# EAGLE design Winston-TOP (EAGLE 9.5.1)
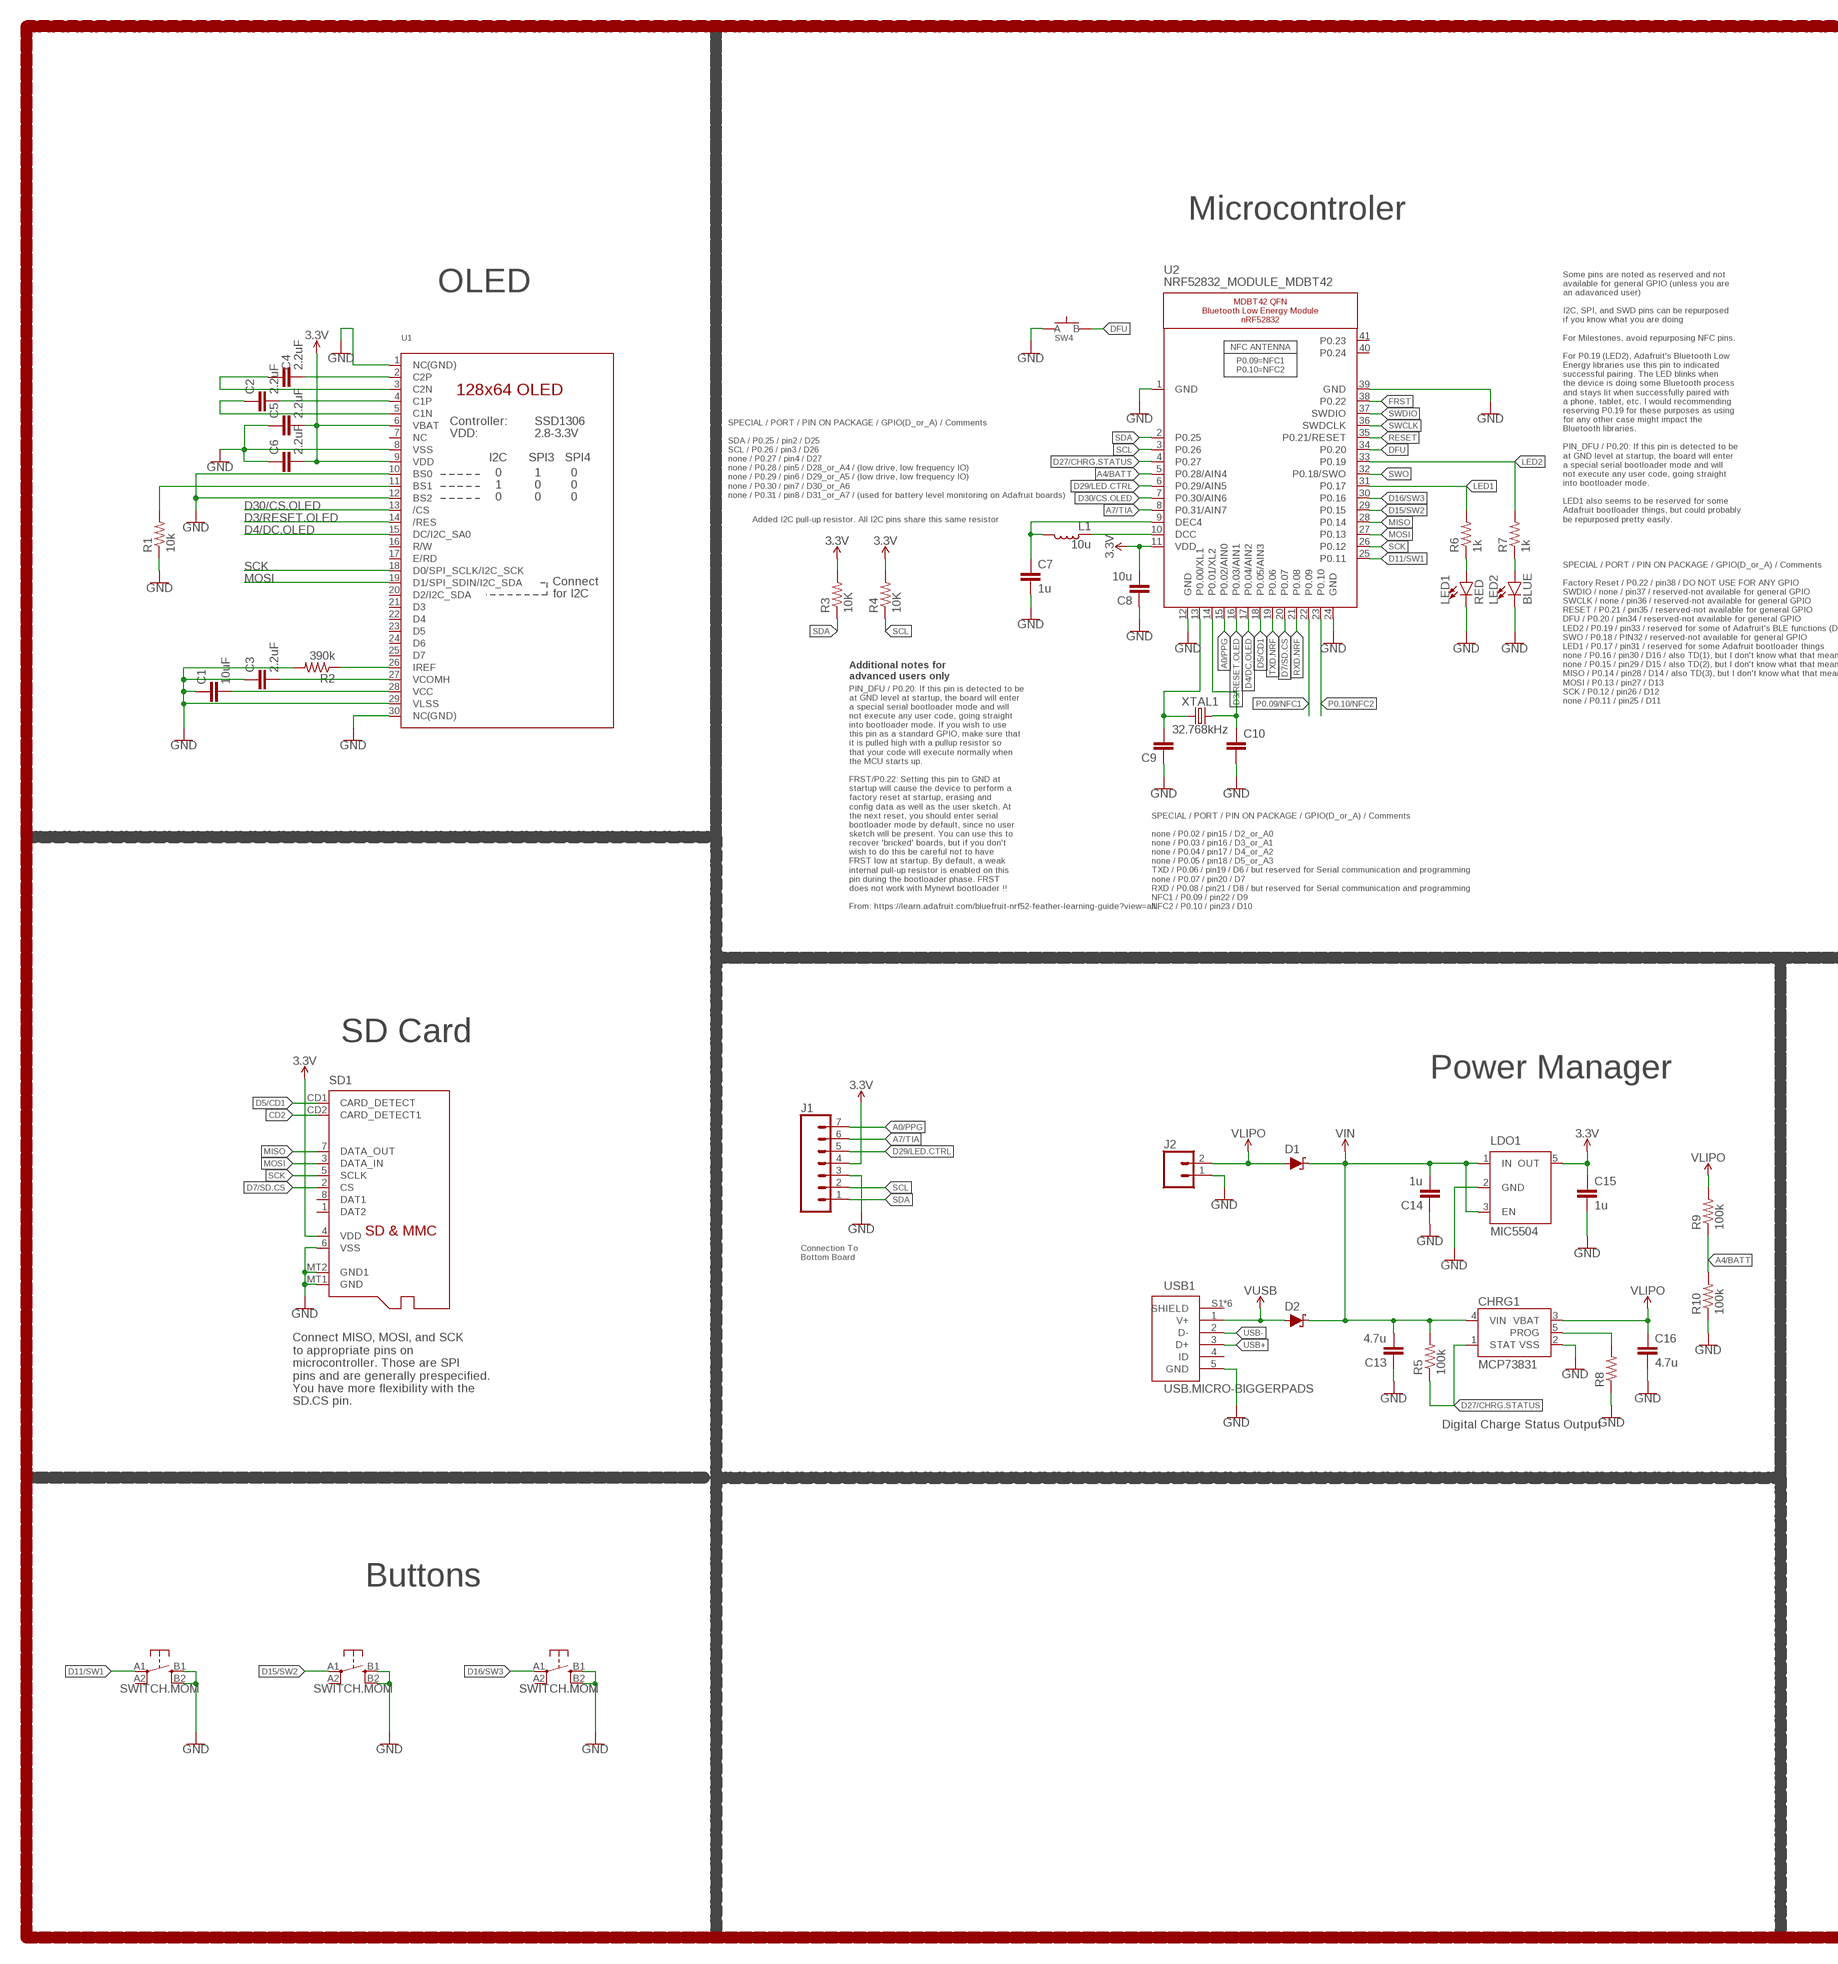
[diagram p0: schematic, sheet 1, part 1 of 2]
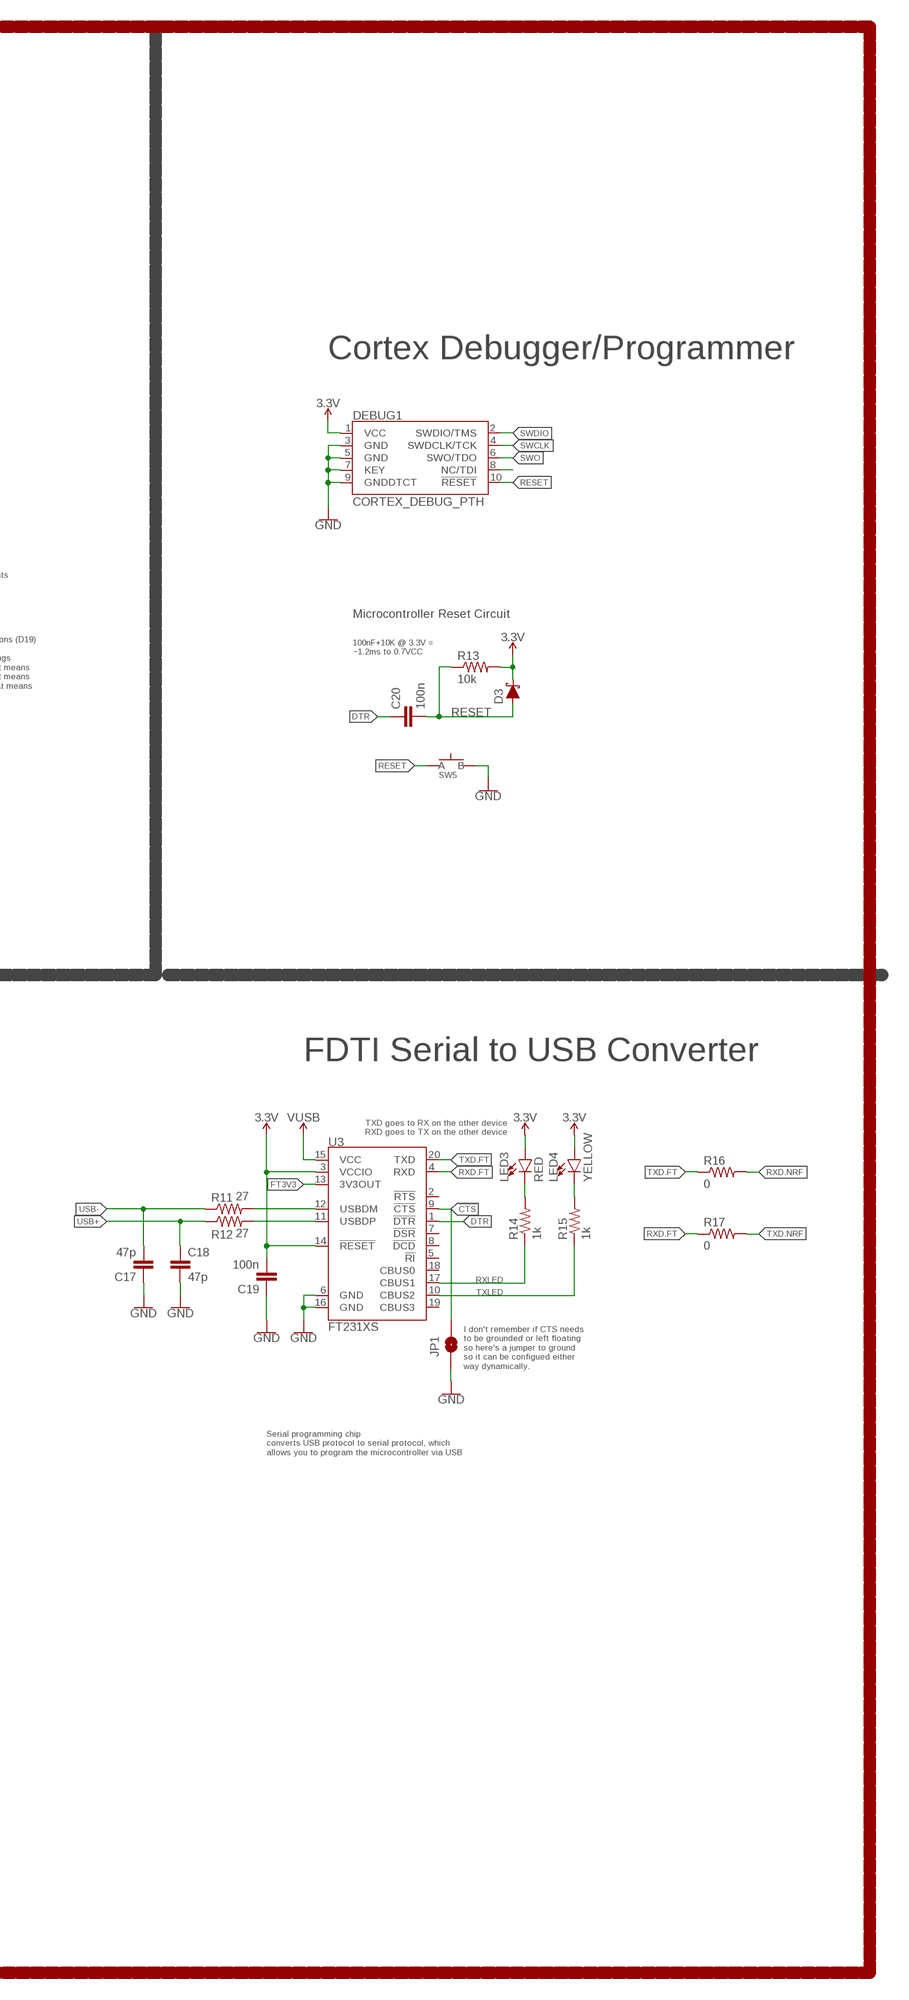
[diagram p1: schematic, sheet 1, part 2 of 2]

## Parts
C1  10uF  CAPACITOR0603  [C0603]
C2  2.2uF  CAPACITOR0402  [C0402]
C3  2.2uF  CAPACITOR0402  [C0402]
C4  2.2uF  CAPACITOR0402  [C0402]
C5  2.2uF  CAPACITOR0402  [C0402]
C6  2.2uF  CAPACITOR0402  [C0402]
C7  1u  CAPACITOR0603  [C0603]
C8  10u  CAPACITOR0805  [C0805]
C9  CAPACITOR0603  [C0603]
C10  CAPACITOR0603  [C0603]
C13  4.7u  CAPACITOR0603  [C0603]
C14  1u  CAPACITOR0603  [C0603]
C15  1u  CAPACITOR0603  [C0603]
C16  4.7u  CAPACITOR0603  [C0603]
C17  47p  CAPACITOR0603  [C0603]
C18  47p  CAPACITOR0603  [C0603]
C19  100n  CAPACITOR0603  [C0603]
C20  100n  CAPACITOR0603  [C0603]
CHRG1  MCP73831  [SOT23-5]
D1  SCHOTTKY-USC  [USC]
D2  SCHOTTKY-USC  [USC]
D3  SCHOTTKY-USC  [USC]
DEBUG1  CORTEX_DEBUG_PTH  [2X5-PTH-1.27MM]
J1  CONN_07-1.27MM  [1X07_1.27MM]
J2  CONN_02  [1X02]
JP1  JUMPER-SMT_2_NO_SILK  [SMT-JUMPER_2_NO_SILK]
L1  10u  INDUCTOR0603  [L0603]
LDO1  MIC5504  [SOT23-5]
LED1  RED  LED0603  [LED-0603]
LED2  BLUE  LED0603  [LED-0603]
LED3  RED  LED0603  [LED-0603]
LED4  YELLOW  LED0603  [LED-0603]
R1  10k  RESISTOR0603  [R0603]
R2  390k  RESISTOR0603  [R0603]
R3  10K  RESISTOR0603  [R0603]
R4  10K  RESISTOR0603  [R0603]
R5  100k  RESISTOR0603  [R0603]
R6  1k  RESISTOR0603  [R0603]
R7  1k  RESISTOR0603  [R0603]
R8  RESISTOR0603  [R0603]
R9  100k  RESISTOR0603  [R0603]
R10  100k  RESISTOR0603  [R0603]
R11  27  RESISTOR0603  [R0603]
R12  27  RESISTOR0603  [R0603]
R13  10k  RESISTOR0603  [R0603]
R14  1k  RESISTOR0603  [R0603]
R15  1k  RESISTOR0603  [R0603]
R16  0  RESISTOR0603  [R0603]
R17  0  RESISTOR0603  [R0603]
SD1  MICROSD  [MICROSD]
SW1  SWITCH.MOM  [TACTILE_SWITCH_SMD_6.2MM_TALL]
SW2  SWITCH.MOM  [TACTILE_SWITCH_SMD_6.2MM_TALL]
SW3  SWITCH.MOM  [TACTILE_SWITCH_SMD_6.2MM_TALL]
SW4  SPST-PTS830GG140-COPY.1-3  [BUTTON-GULLWING]
SW5  SPST-PTS830GG140-COPY.1-3  [BUTTON-GULLWING]
U1  DISP_OLED_UG-2864HSWEG01-NO-WRAPAROUND  [UG-2864HSWEG01_0.96IN_NO-WRAPAROUND]
U2  NRF52832_MODULE_MDBT42  [BLE_MODULE_RAYTAC_MDBT42]
U3  FT231XS  [SSOP20_L]
USB1  USB.MICRO-BIGGERPADS  [USB-MICRO-01.BIGGERPADS]
XTAL1  32.768kHz  CRYSTALECS-.327-12.5-12-C-TR  [2-SMD.NOLEAD.2.0MMTO1.2MM]

## Nets
3.3V: C5.2 C6.2 C8.2 C15.1 C19.2 D3.-(C) DEBUG1.1(VCC) J1.4 LDO1.5(OUT) LED3.A LED4.A R3.2 R4.2 R13.2 SD1.4(VDD) U1.6(VBAT) U1.9(VDD) U2.11(VDD) U3.3(VCCIO) U3.14(!RESET)
!CTS: JP1.2 U3.9(!CTS)
A0/PPG: J1.7 U2.15(P0.02/AIN0)
A4/BATT: R9.1 R10.2 U2.5(P0.28/AIN4)
A7/TIA: J1.6 U2.8(P0.31/AIN7)
CD2: SD1.CD2(CARD_DETECT1)
D3/RESET.OLED: U1.14(/RES) U2.16(P0.03/AIN1)
D4/DC.OLED: U1.15(DC/I2C_SA0) U2.17(P0.04/AIN2)
D5/CD1: SD1.CD1(CARD_DETECT) U2.18(P0.05/AIN3)
D7/SD.CS: SD1.2(CS) U2.20(P0.07)
D11/SW1: SW1.A1 U2.25(P0.11)
D15/SW2: SW2.A1 U2.29(P0.15)
D16/SW3: SW3.A1 U2.30(P0.16)
D27/CHRG.STATUS: CHRG1.1(STAT) R5.1 U2.4(P0.27)
D29/LED.CTRL: J1.5 U2.6(P0.29/AIN5)
D30/CS.OLED: U1.13(/CS) U2.7(P0.30/AIN6)
DFU: SW4.3(B) U2.34(P0.20)
DTR: C20.1 U3.1(!DTR)
FRST: U2.38(P0.22)
FT3V3: U3.13(3V3OUT)
GND: C1.1 C3.1 C5.1 C6.1 C7.2 C8.1 C9.1 C10.2 C13.1 C14.1 C15.2 C16.2 C17.1 C18.2 C19.1 CHRG1.2(VSS) DEBUG1.3(GND) DEBUG1.5(GND) DEBUG1.7(KEY) DEBUG1.9(GNDDTCT) J1.3 J2.1 JP1.1 LDO1.2(GND) LED1.C LED2.C R1.1 R2.2 R8.1 R10.1 SD1.6(VSS) SD1.MT1(GND) SD1.MT2(GND1) SW1.B1 SW1.B2 SW2.B1 SW2.B2 SW3.B1 SW3.B2 SW4.1(A) SW5.3(B) U1.1(NC(GND)) U1.8(VSS) U1.10(BS0) U1.12(BS2) U1.29(VLSS) U1.30(NC(GND)) U2.1(GND) U2.12(GND) U2.24(GND) U2.39(GND) U3.6(GND) U3.16(GND) USB1.5(GND)
LED1: R6.2 U2.31(P0.17)
LED2: R7.2 U2.33(P0.19)
MISO: SD1.7(DATA_OUT) U2.28(P0.14)
MOSI: SD1.3(DATA_IN) U1.19(D1/SPI_SDIN/I2C_SDA) U2.27(P0.13)
N$1: R1.2 U1.11(BS1)
N$2: R2.1 U1.26(IREF)
N$3: C4.2 U1.2(C2P)
N$4: C9.2 U2.13(P0.00/XL1) XTAL1.P$1
N$5: C4.1 U1.3(C2N)
N$6: C10.1 U2.14(P0.01/XL2) XTAL1.P$2
N$7: C2.2 U1.4(C1P)
N$8: C2.1 U1.5(C1N)
N$9: LED1.A R6.1
N$10: LED2.A R7.1
N$11: L1.1 U2.10(DCC)
N$12: C7.1 L1.2 U2.9(DEC4)
N$13: C1.2 U1.28(VCC)
N$14: DEBUG1.8(NC/TDI)
N$15: C3.2 U1.27(VCOMH)
N$16: CHRG1.5(PROG) R8.2
N$23: R11.2 U3.12(USBDM)
N$24: R12.2 U3.11(USBDP)
N$25: LED3.C R14.2
N$26: LED4.C R15.2
P0.09/NFC1: U2.22(P0.09)
P0.10/NFC2: U2.23(P0.10)
RESET: C20.2 D3.+(A) DEBUG1.10(!RESET) R13.1 SW5.1(A) U2.35(P0.21/RESET)
RXD.FT: R17.1 U3.4(RXD)
RXD.NRF: R16.2 U2.21(P0.08)
RXLED: R14.1 U3.17(CBUS1)
SCK: SD1.5(SCLK) U1.18(D0/SPI_SCLK/I2C_SCK) U2.26(P0.12)
SCL: J1.2 R4.1 U2.3(P0.26)
SDA: J1.1 R3.1 U2.2(P0.25)
SWCLK: DEBUG1.4(SWDCLK/TCK) U2.36(SWDCLK)
SWDIO: DEBUG1.2(SWDIO/TMS) U2.37(SWDIO)
SWO: DEBUG1.6(SWO/TDO) U2.32(P0.18/SWO)
TXD.FT: R16.1 U3.20(TXD)
TXD.NRF: R17.2 U2.19(P0.06)
TXLED: R15.1 U3.10(CBUS2)
USB+: C18.1 R12.1 USB1.3(D+)
USB-: C17.2 R11.1 USB1.2(D-)
V_USB: D2.+(A) U3.15(VCC) USB1.1(V+) ; supply symbol labelled VUSB
VIN: C13.2 C14.2 CHRG1.4(VIN) D1.-(C) D2.-(C) LDO1.1(IN) LDO1.3(EN) R5.2
VLIPO: C16.1 CHRG1.3(VBAT) D1.+(A) J2.2 R9.2
Unconnected: SD1.1(DAT2) SD1.8(DAT1) SW1.A2 SW2.A2 SW3.A2 U1.7(NC) U1.16(R/W) U1.17(E/RD) U1.20(D2/I2C_SDA) U1.21(D3) U1.22(D4) U1.23(D5) U1.24(D6) U1.25(D7) U2.40(P0.24) U2.41(P0.23) U3.2(!RTS) U3.5(!RI) U3.7(!DSR) U3.8(!DCD) U3.18(CBUS0) U3.19(CBUS3) USB1.4(ID) USB1.S1(SHIELD) USB1.S2(SHIELD) USB1.S3(SHIELD) USB1.S4(SHIELD) USB1.S5(SHIELD) USB1.S6(SHIELD)

## Notes on the sheet
- Microcontroler
- OLED
- Cortex Debugger/Programmer
- SPECIAL / PORT / PIN ON PACKAGE / GPIO(D_or_A) / Comments
  
  SDA / P0.25 / pin2 / D25
  SCL / P0.26 / pin3 / D26
  none / P0.27 / pin4 / D27
  none / P0.28 / pin5 / D28_or_A4 / (low drive, low frequency IO)
  none / P0.29 / pin6 / D29_or_A5 / (low drive, low frequency IO)
  none / P0.30 / pin7 / D30_or_A6
  none / P0.31 / pin8 / D31_or_A7 / (used for battery level monitoring on Adafruit boards)
- Added I2C pull-up resistor. All I2C pins share this same resistor
- Some pins are noted as reserved and not
  available for general GPIO (unless you are
  an adavanced user)
  
  I2C, SPI, and SWD pins can be repurposed
  if you know what you are doing
  
  For Milestones, avoid repurposing NFC pins.
  
  For P0.19 (LED2), Adafruit's Bluetooth Low
  Energy libraries use this pin to indicated
  successful pairing. The LED blinks when
  the device is doing some Bluetooth process
  and stays lit when successfully paired with
  a phone, tablet, etc. I would recommending
  reserving P0.19 for these purposes as using
  for any other case might impact the
  Bluetooth libraries.
  
  PIN_DFU / P0.20: If this pin is detected to be
  at GND level at startup, the board will enter
  a special serial bootloader mode and will
  not execute any user code, going straight
  into bootloader mode.
  
  LED1 also seems to be reserved for some
  Adafruit bootloader things, but could probably
  be repurposed pretty easily.
- Microcontroller Reset Circuit
- 100nF+10K @ 3.3V =
  ~1.2ms to 0.7VCC
- Additional notes for
  advanced users only
- SPECIAL / PORT / PIN ON PACKAGE / GPIO(D_or_A) / Comments
  
  Factory Reset / P0.22 / pin38 / DO NOT USE FOR ANY GPIO
  SWDIO / none / pin37 / reserved-not available for general GPIO
  SWCLK / none / pin36 / reserved-not available for general GPIO
  RESET / P0.21 / pin35 / reserved-not available for general GPIO
  DFU / P0.20 / pin34 / reserved-not available for general GPIO
  LED2 / P0.19 / pin33 / reserved for some of Adafruit's BLE functions (D19)
  SWO / P0.18 / PIN32 / reserved-not available for general GPIO
  LED1 / P0.17 / pin31 / reserved for some Adafruit bootloader things
  none / P0.16 / pin30 / D16 / also TD(1), but I don't know what that means
  none / P0.15 / pin29 / D15 / also TD(2), but I don't know what that means
  MISO / P0.14 / pin28 / D14 / also TD(3), but I don't know what that means
  MOSI / P0.13 / pin27 / D13
  SCK / P0.12 / pin26 / D12
  none / P0.11 / pin25 / D11
- PIN_DFU / P0.20: If this pin is detected to be
  at GND level at startup, the board will enter
  a special serial bootloader mode and will
  not execute any user code, going straight
  into bootloader mode. If you wish to use
  this pin as a standard GPIO, make sure that
  it is pulled high with a pullup resistor so
  that your code will execute normally when
  the MCU starts up.
  
  FRST/P0.22: Setting this pin to GND at
  startup will cause the device to perform a
  factory reset at startup, erasing and
  config data as well as the user sketch. At
  the next reset, you should enter serial
  bootloader mode by default, since no user
  sketch will be present. You can use this to
  recover 'bricked' boards, but if you don't
  wish to do this be careful not to have
  FRST low at startup. By default, a weak
  internal pull-up resistor is enabled on this
  pin during the bootloader phase. FRST
  does not work with Mynewt bootloader !!
  
  From: https://learn.adafruit.com/bluefruit-nrf52-feather-learning-guide?view=all
- SPECIAL / PORT / PIN ON PACKAGE / GPIO(D_or_A) / Comments
  
  none / P0.02 / pin15 / D2_or_A0
  none / P0.03 / pin16 / D3_or_A1
  none / P0.04 / pin17 / D4_or_A2
  none / P0.05 / pin18 / D5_or_A3
  TXD / P0.06 / pin19 / D6 / but reserved for Serial communication and programming
  none / P0.07 / pin20 / D7
  RXD / P0.08 / pin21 / D8 / but reserved for Serial communication and programming
  NFC1 / P0.09 / pin22 / D9
  NFC2 / P0.10 / pin23 / D10
- SD Card | FDTI Serial to USB Converter
- Power Manager
- TXD goes to RX on the other device
  RXD goes to TX on the other device
- Connection To
  Bottom Board
- I don't remember if CTS needs
  to be grounded or left floating
  so here's a jumper to ground
  so it can be configued either
  way dynamically.
- Connect MISO, MOSI, and SCK
  to appropriate pins on
  microcontroller. Those are SPI
  pins and are generally prespecified.
  You have more flexibility with the
  SD.CS pin.
- Serial programming chip
  converts USB protocol to serial protocol, which 
  allows you to program the microcontroller via USB
- Digital Charge Status Output
- Buttons

## Library data of the parts
C1-C10 C13-C20 = LinnesLab-Passives:CAPACITOR
CHRG1 = LinnesLab-Power:MCP73831: MCP73831T Li-Ion, Li-Pol Controller Miniature single cell, fully integrated Li-Ion, Li-polymer charge management controller Datasheet <http://ww1.microchip.com/downloads/en/DeviceDoc/20001984g.pdf> SparkFun Products: SparkFun ESP32 Thing <https://www.sparkfun.com/products/13907> SparkFun 9DoF Razor IMU M0 <https://www.sparkfun.com/products/14001>; PROD_ID: IC-09995
D1-D3 = LinnesLab-DiscreteSemi:SCHOTTKY: Schottky diode A Schottky diode is a semiconductor diode which has a low forward voltage drop and a very fast switching action. Example: Digi-Key Part Number: RB161MM-20CT-ND
DEBUG1 = LinnesLab-Connectors:CORTEX_DEBUG: Cortex Debug Connector - 10 pin Supports JTAG debug, Serial Wire debug, and Serial Wire Viewer. PTH and SMD connector options available. General Connector Information <http://infocenter.arm.com/help/topic/com.arm.doc.faqs/attached/13634/cortex_debug_connectors.pdf> Products: PTH Connector <http://www.digikey.com/product-detail/en/cnc-tech/3220-10-0100-00/1175-1627-ND/3883661> -via Digi-Key SparkFun PSoc <https://www.sparkfun.com/products/13229> SparkFun T <https://www.sparkfun.com/products/13810>
J1 = LinnesLab-Connectors:CONN_07: Multi connection point. Often used as Generic Header-pin footprint for 0.1 inch spaced/style header connections On any of the 0.1 inch spaced packages, you can populate with these: Break Away Headers - Straight <https://www.sparkfun.com/products/116> (PRT-00116) Break Away Male Headers - Right Angle <https://www.sparkfun.com/products/553> (PRT-00553) Female Headers <https://www.sparkfun.com/products/115> (PRT-00115) Break Away Headers - Machine Pin <https://www.sparkfun.com/products/117> (PRT-00117) Break Away Female Headers - Swiss Machine Pin <https://www.sparkfun.com/products/743> (PRT-00743) For SCREWTERMINALS and SPRING TERMINALS visit here: Screw Terimnals on SparkFun.com <https://www.sparkfun.com/search/results?term=Screw+Terminals> (5mm/3.5mm/2.54mm spacing) This device is also useful as a general connection point to wire up your design to another part of your project. Our various solder wires solder well into these plated through hole pads. Hook-Up Wire - Assortment (Stranded, 22 AWG) <https://www.sparkfun.com/products/11375> (PRT-11375) Hook-Up Wire - Assortment (Solid Core, 22 AWG) <https://www.sparkfun.com/products/11367> (PRT-11367) View the entire wire category on our website here <https://www.sparkfun.com/categories/141> Special notes: Molex polarized connector foot print use with SKU : PRT-08231 with associated crimp pins and housings. 1MM SMD Version SKU: PRT-10208 NOTES ON THE VARIANTS LOCK and LOCK_LONGPADS... This footprint was designed to help hold the alignment of a through-hole component (i.e. 6-pin header) while soldering it into place. You may notice that each hole has been shifted either up or down by 0.005 of an inch from it's more standard position (which is a perfectly straight line). This slight alteration caused the pins (the squares in the middle) to touch the edges of the holes. Because they are alternating, it causes a "brace" to hold the component in place. 0.005 has proven to be the perfect amount of "off-center" position when using our standard breakaway headers. Although looks a little odd when you look at the bare footprint, once you have a header in there, the alteration is very hard to notice. Also,if you push a header all the way into place, it is covered up entirely on the bottom side.
J2 = LinnesLab-Connectors:CONN_02: Multi connection point. Often used as Generic Header-pin footprint for 0.1 inch spaced/style header connections On any of the 0.1 inch spaced packages, you can populate with these: Break Away Headers - Straight <https://www.sparkfun.com/products/116> (PRT-00116) Break Away Male Headers - Right Angle <https://www.sparkfun.com/products/553> (PRT-00553) Female Headers <https://www.sparkfun.com/products/115> (PRT-00115) Break Away Headers - Machine Pin <https://www.sparkfun.com/products/117> (PRT-00117) Break Away Female Headers - Swiss Machine Pin <https://www.sparkfun.com/products/743> (PRT-00743) For SCREWTERMINALS and SPRING TERMINALS visit here: Screw Terimnals on SparkFun.com <https://www.sparkfun.com/search/results?term=Screw+Terminals> (5mm/3.5mm/2.54mm spacing) This device is also useful as a general connection point to wire up your design to another part of your project. Our various solder wires solder well into these plated through hole pads. Hook-Up Wire - Assortment (Stranded, 22 AWG) <https://www.sparkfun.com/products/11375> (PRT-11375) Hook-Up Wire - Assortment (Solid Core, 22 AWG) <https://www.sparkfun.com/products/11367> (PRT-11367) View the entire wire category on our website here <https://www.sparkfun.com/categories/141> Special notes: Molex polarized connector foot print use with: PRT-08233 with associated crimp pins and housings. 2.54_SCREWTERM for use with PRT-10571. 3.5mm Screw Terminal footprints for PRT-08084 5mm Screw Terminal footprints for use with PRT-08432
JP1 = LinnesLab-Switches:JUMPER-SMT_2_NO: Normally open jumper This jumper has two pads in close proximity to each other. Apply solder to close the connection. Round pads are easier to solder for beginners, but are a lot larger. SparkFun Product that uses the round pads: SparkFun EL Sequencer <https://www.sparkfun.com/products/12781>
L1 = LinnesLab-Passives:INDUCTOR
LDO1 = LinnesLab-Power:MIC5504: MIC5504 Voltage Regulator Output Voltages: 1.0V to 3.3V Input Voltages: 2.5V to 5.5V Link to Datasheet http://ww1.microchip.com/downloads/en/DeviceDoc/MIC550X.pdf
LED1-LED4 = LinnesLab-LED:LED: LED (Generic) Standard schematic elements and footprints for 5mm, 3mm, 1206, and 0603 sized LEDs. Generic LEDs with no color specified. LTST-C190KGKT: arrow indicates cathode
R1-R17 = LinnesLab-Passives:RESISTOR
SD1 = LinnesLab-Connectors:MICROSD: Micro-SD / Transflash card holder with SPI pinout For the 3M # 2908-05WB-MG and/or 4UCON #19656 push-push type
SW1-SW3 = LinnesLab-Switches:SWITCH.MOM: PTS645SM43SMTR92 LFS
SW4 SW5 = LinnesLab-Switches:SPST-PTS830GG140-COPY
U1 = LinnesLab-Displays:DISP_OLED_UG-2864HSWEG01: UG-2864HSWEG01 OLED display Both 1.3" and 0.96" models share the same FPC tab footprint, only the screen dimensions vary.
U2 = LinnesLab-Microcontrollers:NRF52832_MODULE_MDBT42: MDBT42 - BLE Module (nRF52832 QFN) VDD: 1.7-3.6V
U3 = LinnesLab-DigitalIC:FT231X: FTDI FT231X Full Speed USB to Full-handshake UART This USB2.0 Full Speed IC offers a compact bridge to full handshake UART interfaces. The device is a UART, capable of operating up to 3MBaud, with low power consumption (8mA). The FT231X includes the complete FT-X series feature set and enables USB to be added into a system design quickly and easily over a UART interface. Datasheet <http://cdn.sparkfun.com/datasheets/Components/General%20IC/DS_FT231X.pdf>; DIGIKEY: 768-1156-5-ND; MFN: FT231XS-U
USB1 = LinnesLab-Connectors:USB.MICRO: DigiKey PN: 609-4613-1-ND
XTAL1 = LinnesLab-Clocks:CRYSTAL; DIGIKEY: XC2288CT-ND; FREQ: 32.7680KHZ; LOAD_CAP: 12.5pF

## Board
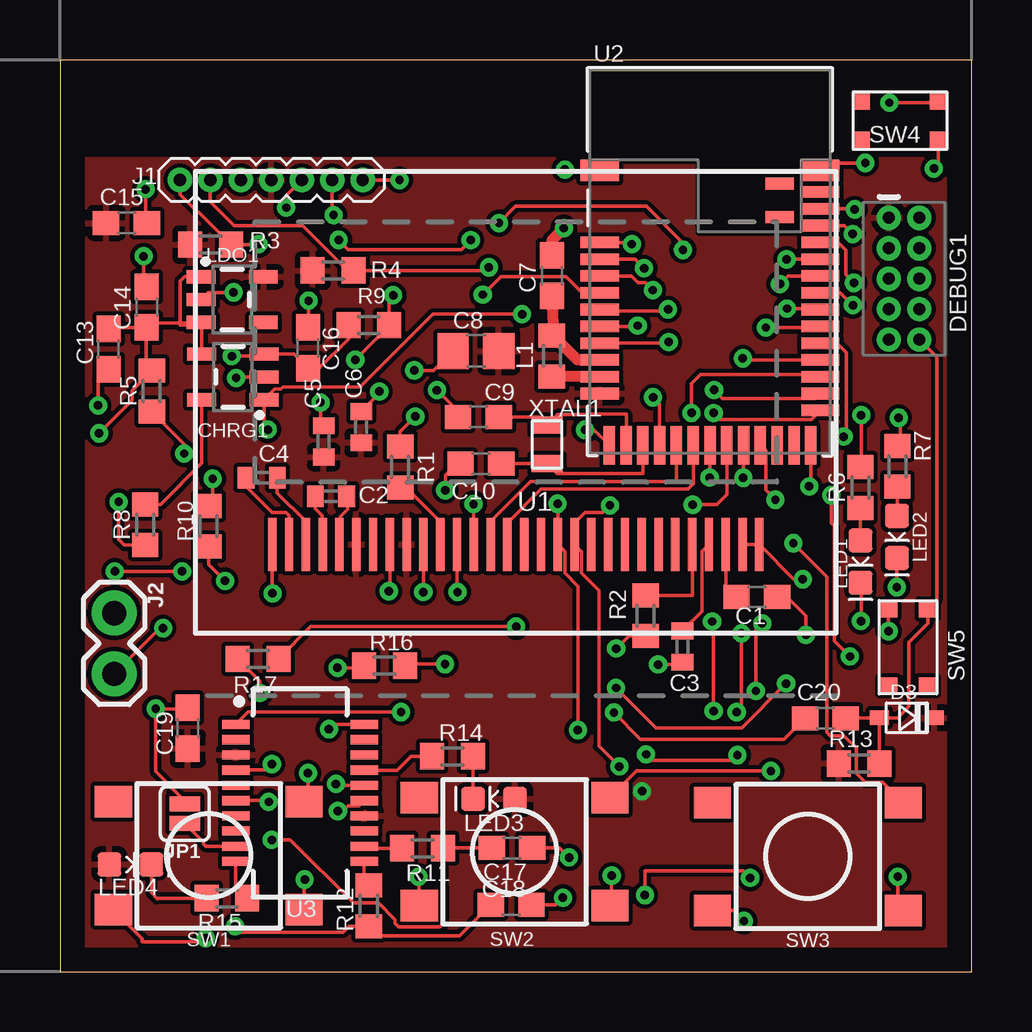
[diagram p2: board, top side]
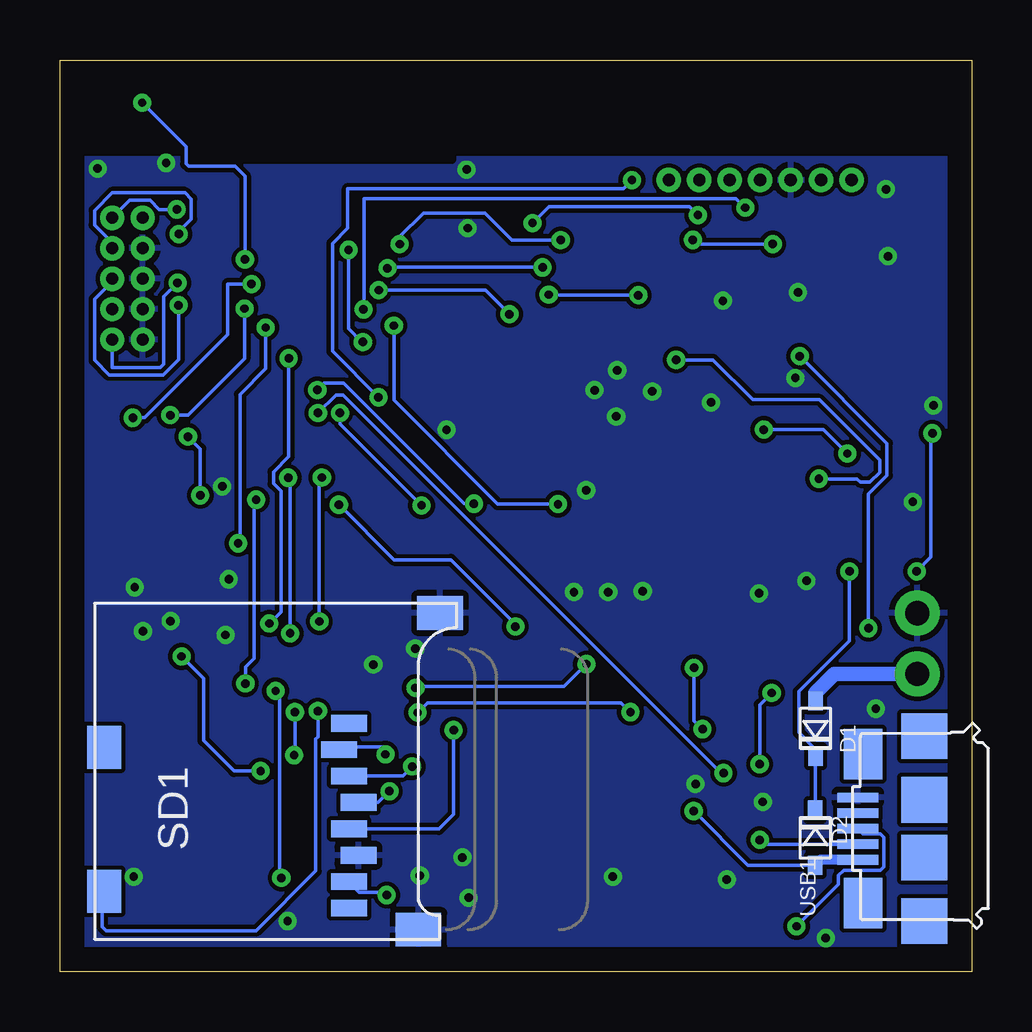
[diagram p3: board, bottom side, seen from below]

Size 38 x 38 mm. Coordinates in mm from the lower left corner, seen from the top.
Outline: 0,0 38,0 38,38 0,38 0,0
Copper layers (1*16): Top 0.035mm / dielectric 1.5mm / Bottom 0.035mm
Design rules "default": minimum track width 6mil, minimum drill 0.35mm, track to track 6mil, track to pad 6mil, pad to pad 6mil, via to via 6mil, smd to smd 6mil, copper to edge 40mil, drill to drill 6mil, minimum pad ring 10mil, minimum via ring 8mil, stop-mask expansion 4mil, vias tented up to drill 0mil, thermal gap 10mil

### Footprints (pad centres in the part's own frame; a part is rotated, then mirrored left to right if it is on the bottom)
C0603 = smd 1.1 x 1: 1 -0.85,0; 2 0.85,0
C0402 = smd 0.7 x 0.9: 1 -0.65,0; 2 0.65,0
C0805 = smd 1.3 x 1.5: 1 -0.95,0; 2 0.95,0
SOT23-5 = smd 0.55 x 1.2: 1 -0.95,-1.3; 2 0,-1.3; 3 0.95,-1.3; 4 0.95,1.3; 5 -0.95,1.3
USC = smd 0.8 x 0.6: + -1.15,0; - 1.15,0
2X5-PTH-1.27MM = drill 0.508 pad 1: 1 -2.54,-0.635; 2 -2.54,0.635; 3 -1.27,-0.635; 4 -1.27,0.635; 5 0,-0.635; 6 0,0.635; 7 1.27,-0.635; 8 1.27,0.635; 9 2.54,-0.635; 10 2.54,0.635
1X07_1.27MM = drill 0.508 pad 1: 1 0,0; 2 1.27,0; 3 2.54,0; 4 3.81,0; 5 5.08,0; 6 6.35,0; 7 7.62,0
1X02 = drill 1.016 pad 1.88: 1 0,0; 2 2.54,0
SMT-JUMPER_2_NO_SILK = smd 0.635 x 1.27: 1 -0.406,0; 2 0.406,0
L0603 = smd 1 x 1.1: 1 -0.85,0; 2 0.85,0
LED-0603 = smd 1 x 1: A -0.877,0; C 0.877,0
R0603 = smd 1 x 1.1: 1 -0.85,0; 2 0.85,0
MICROSD = smd 0.7 x 1.5: 1 9,-10.64; 2 7.9,-10.24; 3 6.8,-10.64; 4 5.7,-11.04; 5 4.6,-10.64; 6 3.5,-11.04; 7 2.4,-10.64; 8 1.3,-10.64 | smd 1.8 x 1.4: CD1 2,-0.44; CD2 8,-0.44 | smd 1.4 x 1.9: MT1 0.4,-13.54; MT2 13.6,-14.44
TACTILE_SWITCH_SMD_6.2MM_TALL = smd 1.55 x 1.3: A1 -3.975,-2.25; A2 3.975,-2.25; B1 -3.975,2.25; B2 3.975,2.25
BUTTON-GULLWING = smd 0.7 x 0.75: 1 -1.6,0.825; 2 1.6,0.825; 3 -1.6,-0.825; 4 1.6,-0.825
UG-2864HSWEG01_0.96IN_NO-WRAPAROUND = smd 0.35 x 2.2: 1 -10.15,-1.2; 2 -9.45,-1.2; 3 -8.75,-1.2; 4 -8.05,-1.2; 5 -7.35,-1.2; 6 -6.65,-1.2; 7 -5.95,-1.2; 8 -5.25,-1.2; 9 -4.55,-1.2; 10 -3.85,-1.2; 11 -3.15,-1.2; 12 -2.45,-1.2; 13 -1.75,-1.2; 14 -1.05,-1.2; 15 -0.35,-1.2; 16 0.35,-1.2; 17 1.05,-1.2; 18 1.75,-1.2; 19 2.45,-1.2; 20 3.15,-1.2; 21 3.85,-1.2; 22 4.55,-1.2; 23 5.25,-1.2; 24 5.95,-1.2; 25 6.65,-1.2; 26 7.35,-1.2; 27 8.05,-1.2; 28 8.75,-1.2; 29 9.45,-1.2; 30 10.15,-1.2
BLE_MODULE_RAYTAC_MDBT42 = smd 1.6 x 0.9: 1 -4.6,3.8; 39 4.6,3.8 | smd 1.6 x 0.48: 2 -4.6,0.8; 3 -4.6,0.1; 4 -4.6,-0.6; 5 -4.6,-1.3; 6 -4.6,-2; 7 -4.6,-2.7; 8 -4.6,-3.4; 9 -4.6,-4.1; 10 -4.6,-4.8; 11 -4.6,-5.5; 25 4.6,-6.2; 26 4.6,-5.5; 27 4.6,-4.8; 28 4.6,-4.1; 29 4.6,-3.4; 30 4.6,-2.7; 31 4.6,-2; 32 4.6,-1.3; 33 4.6,-0.6; 34 4.6,0.1; 35 4.6,0.8; 36 4.6,1.5; 37 4.6,2.2; 38 4.6,2.9 | smd 0.48 x 1.6: 12 -4.2,-7.65; 13 -3.5,-7.65; 14 -2.8,-7.65; 15 -2.1,-7.65; 16 -1.4,-7.65; 17 -0.7,-7.65; 18 0,-7.65; 19 0.7,-7.65; 20 1.4,-7.65; 21 2.1,-7.65; 22 2.8,-7.65; 23 3.5,-7.65; 24 4.2,-7.65 | smd 1.2 x 0.5: 40 2.9,3.25; 41 2.9,1.85
SSOP20_L = smd 0.381 x 1.143: 1 -2.857,-2.68; 2 -2.223,-2.68; 3 -1.587,-2.68; 4 -0.953,-2.68; 5 -0.318,-2.68; 6 0.318,-2.68; 7 0.953,-2.68; 8 1.587,-2.68; 9 2.223,-2.68; 10 2.857,-2.68; 11 2.857,2.68; 12 2.223,2.68; 13 1.587,2.68; 14 0.953,2.68; 15 0.318,2.68; 16 -0.318,2.68; 17 -0.953,2.68; 18 -1.587,2.68; 19 -2.223,2.68; 20 -2.857,2.68
USB-MICRO-01.BIGGERPADS = smd 0.4 x 1.7: 1 -1.3,1.505; 2 -0.65,1.505; 3 0,1.505; 4 0.65,1.505; 5 1.3,1.505 | smd 1.9 x 1.9: S1 -3.85,-1.27; S2 -1.2,-1.27; S3 1.2,-1.27; S4 3.85,-1.27 | smd 2.1 x 1.6: S5 -3.1,1.28; S6 3.1,1.28
2-SMD.NOLEAD.2.0MMTO1.2MM = smd 0.7 x 1.3: P$1 -0.8,0; P$2 0.8,0

### Placement (x,y rotation side)
C1  29.05,15.62 180 top
C2  11.29,19.82 180 top
C3  25.95,13.54 90 top
C4  8.41,20.58 180 top
C5  10.99,22.1 270 top
C6  12.56,22.69 270 top
C7  20.52,29.01 90 top
C8  17.34,25.87 0 top
C9  17.44,23.11 0 top
C10  17.55,21.17 180 top
C13  2.02,25.95 90 top
C14  3.62,27.7 270 top
C15  2.77,31.21 0 top
C16  10.35,26 90 top
C17  18.84,5.16 180 top
C18  18.81,2.79 0 top
C19  5.32,10.15 270 top
C20  31.9,10.56 0 top
CHRG1  7.21,24.79 90 top
D1  6.51,10.13 270 bottom
D2  6.52,5.58 90 bottom
D3  35.3,10.58 0 top
DEBUG1  35.19,28.88 270 top
J1  5,33 0 top
J2  2.26,14.95 270 top
JP1  5.2,6.58 270 top
L1  20.51,25.66 90 top
LDO1  7.18,28.01 270 top
LED1  33.37,17.09 270 top
LED2  34.89,18.12 270 top
LED3  18.09,7.2 180 top
LED4  2.94,4.46 0 top
R1  14.18,21.03 270 top
R2  24.41,14.83 270 top
R3  6.28,30.3 180 top
R4  11.39,29.23 180 top
R5  3.83,24.2 90 top
R6  33.36,20.18 90 top
R7  34.9,21.06 90 top
R8  3.55,18.62 90 top
R9  12.87,26.95 180 top
R10  6.2,18.56 90 top
R11  15.11,5.14 180 top
R12  12.88,2.74 90 top
R13  33.31,8.67 180 top
R14  16.36,8.97 0 top
R15  6.96,3.06 180 top
R16  13.53,12.76 0 top
R17  8.26,13.03 0 top
SD1  36.6,1.35 90 bottom
SW1  6.2,4.83 180 top
SW2  18.95,5 180 top
SW3  31.18,4.8 180 top
SW4  35.02,35.47 180 top
SW5  35.35,13.52 270 top
U1  19,19 0 top
U2  27.1,29.59 0 top
U3  10.01,7.44 270 top
USB1  3.24,5.96 90 bottom
XTAL1  20.3,21.98 270 top

### Tracks (layer width: path | path; a pad name or v marks a point on that pad's centre or on a via)
3.3V  (via drill 0.35)
  Bottom 0.152: SD1.4 24.74,7.05 v24.27,7.51
  pour Top (isolate 0.178): 0.81,33.89 37.3,33.89 37.3,0.41 0.8,0.41 0.8,33.87
!CTS
  Top 0.152: JP1.2 5.99,5.38 5.99,5.3 6.07,5.22 U3.9
A0/PPG  (via drill 0.35)
  Top 0.152: U2.15 25,23.66 v24.72,23.94 | v14.15,32.99 J1.7
  Bottom 0.152: v24.72,23.94 26.64,25.86 26.64,30.35 26,30.99 26,32.63 14.52,32.63 v14.15,32.99
A4/BATT  (via drill 0.35)
  Top 0.152: U2.5 21.77,28.29 21.09,28.97 18.38,28.97 v17.62,28.22 | v13.89,28.19 13.72,28.02 R9.1 13.72,26.91 v12.31,25.5 | R10.2 6.37,19.58 v6.37,20.54
  Bottom 0.152: v17.62,28.22 17.62,28.19 v13.89,28.19 | v13.89,28.19 | v6.37,20.54 4.77,20.54 4.64,20.41 4.23,20.41 3.83,20.81 3.83,21.31 6.35,23.84 9.12,23.84 10.78,25.5 v12.31,25.5
A7/TIA  (via drill 0.35)
  Top 0.152: U2.8 25.33,26.19 v25.38,26.24 | J1.6 11.35,31.59 v11.41,31.53 | v18.3,31.2 19,31.9 24.44,31.9 25.97,30.37 v25.97,30.08
  Bottom 0.152: v25.38,26.24 25.42,26.24 25.97,26.79 v25.97,30.08 | v18.3,31.2 17.61,31.89 11.76,31.89 v11.41,31.53
D3/RESET.OLED
  Top 0.152: U2.16 25.7,20.43 19.61,20.43 17.95,18.77 U1.14
D4/DC.OLED
  Top 0.152: U2.17 26.4,20.34 26.17,20.11 20.06,20.11 18.65,18.7 U1.15
D5/CD1  (via drill 0.35)
  Top 0.152: U2.18 27.1,20.61 v27.08,20.59 | v27.19,14.59 27.25,14.53 v27.25,10.86
  Bottom 0.152: SD1.CD1 36.24,3.27 36.24,1.88 36.06,1.7 29.82,1.7 27.34,4.19 27.34,9.69 27.25,9.78 v27.25,10.86 | v27.19,14.59 27.19,20.48 v27.08,20.59
D7/SD.CS  (via drill 0.35)
  Top 0.152: U2.20 28.5,20.6 v28.48,20.58 | v28.24,9.02 28.02,8.8 24.69,8.8 v24.43,9.05 | v28.21,10.81 28.41,11.01 v28.41,14.1
  Bottom 0.152: v24.43,9.05 24.43,9.36 26.24,9.36 SD1.2 | v28.21,10.81 28.21,9.05 v28.24,9.02 | v28.41,14.1 28.41,20.5 v28.48,20.58
D11/SW1  (via drill 0.35)
  Top 0.152: U2.25 31.32,23.01 27.52,23.01 v27.25,23.28 | v10.34,8.27 10.34,7.24 SW1.A1
  Bottom 0.152: v27.25,23.28 26.5,24.04 26.2,24.04 10.43,8.27 v10.34,8.27
D15/SW2  (via drill 0.35)
  Top 0.152: SW2.A1 24.04,8.36 v29.64,8.36 | U2.29 31.73,26.16 32.42,26.16 32.78,25.8 32.78,22.41 v32.66,22.3 | v32.93,13.13 32.28,13.79 32.28,18.56 32.15,18.69 v32.15,19.86
  Bottom 0.152: v29.64,8.36 30.75,8.36 32.02,9.63 32.02,12.22 v32.93,13.13 | v32.15,19.86 32.15,21.79 v32.66,22.3
D16/SW3  (via drill 0.35)
  Top 0.152: SW3.A1 34.3,7.89 33.56,7.89 33.19,8.27 33.19,9.32 32.67,9.83 32.11,9.83 31.98,9.96 31.98,16.45 v30.57,17.85 | v29.43,26.84 31.65,26.84 U2.30
  Bottom 0.152: v29.43,26.84 29.43,25.13 30.49,24.06 30.49,17.93 v30.57,17.85
D27/CHRG.STATUS  (via drill 0.35)
  Top 0.152: v5.18,21.59 5.18,22 R5.1 | v8.66,22.59 8.51,22.74 CHRG1.1 8.96,24.28 9.21,24.28 9.29,24.37 12.52,24.37 15.55,27.4 v19.26,27.4 | U2.4 23.81,28.99 24.1,28.71 24.41,28.71 v24.71,28.41
  Bottom 0.152: v5.18,21.59 6.17,22.59 v8.66,22.59 | v19.26,27.4 20.27,28.41 v24.71,28.41
D29/LED.CTRL  (via drill 0.35)
  Top 0.152: J1.5 9.43,32.35 v9.43,31.84 | v25.35,27.61 25.28,27.53 22.56,27.53 U2.6
  Bottom 0.152: v9.43,31.84 9.81,32.23 25.32,32.23 25.32,27.64 v25.35,27.61
D30/CS.OLED  (via drill 0.35)
  Top 0.152: U2.7 24.05,26.89 v24.08,26.93 | v17.24,19.49 U1.13
  Bottom 0.152: v24.08,26.93 24.08,23.82 19.75,19.49 v17.24,19.49
DFU  (via drill 0.35)
  Top 0.152: SW4.3 36.54,36.22 v34.57,36.22 | v30.29,29.69 U2.34
  Bottom 0.152: v34.57,36.22 32.74,34.38 32.74,33.67 32.63,33.56 30.69,33.56 30.29,33.16 v30.29,29.69
DTR  (via drill 0.35)
  Top 0.152: v23.09,10.8 24.2,9.69 30.18,9.69 C20.1 | v14.22,10.81 7.84,10.81 U3.1
  Bottom 0.152: v23.09,10.8 22.68,11.2 14.61,11.2 v14.22,10.81
GND  (via drill 0.35)
  Top 0.152: U2.12 22.26,22.58 v21.89,22.58 | U1.1 8.85,15.78 v8.86,15.76 | U1.8 13.75,15.89 v13.71,15.86 | U1.10 v15.15,15.82 | U1.12 16.55,15.84 v16.57,15.82 | v30.96,16.35 30.6,16.35 U1.30 U1.29 | LED1.C 33.42,16.17 33.42,14.63 v33.39,14.61 | LED2.C 35.04,17.09 34.89,16.93 v34.89,16.02 | SW5.3 34.52,14.21 v34.54,14.19 | R2.2 23.71,13.98 v23.19,13.46 | C3.1 25.85,12.8 v24.94,12.8 | U2.24 31.3,20.28 v31.23,20.22 | C15.2 3.57,31.26 v3.57,32.61 | v10.37,27.96 10.37,26.87 C16.2 | v3.49,29.82 3.49,28.68 C14.1 | LDO1.2 6.18,28.31 v7.24,28.31 | CHRG1.2 7.39,24.79 v7.34,24.74 | C5.1 10.86,22.88 v10.86,23.72 | v13.31,24.18 13.31,24.17 13.34,24.13 C6.1 | C8.1 15.58,25.06 v14.77,25.06 | v14.81,23.14 14.18,22.51 R1.1 | v16.06,20.06 16.06,20.7 16.53,21.17 C10.2 | C13.1 1.59,24.66 v1.59,23.6 | U2.1 21.09,33.39 v21.05,33.43 | R10.1 6.2,16.97 v6.88,16.29 | R8.1 2.68,17.77 2.45,18 v2.45,19.58 | SW3.B1 34.93,2.77 v34.93,3.95 | SW2.B1 23,2.82 v23,4 | C17.1 20.82,5.16 v21.22,4.76 | C18.2 20.68,2.79 v20.96,3.08 | SW2.B2 14.98,3.93 v14.95,3.95 | SW1.B1 10.18,3.81 v10.2,3.83 | U3.6 8.65,7.13 v8.7,7.07 | U3.16 11.5,7.76 v11.5,7.82 | 3.99,10.94 3.99,8.33 5.27,7.06 JP1.1 | 3.99,10.94 v3.99,10.96 | C19.1 5.27,10.94 3.99,10.94 | SW4.1 36.62,33.66 v36.43,33.47 | U2.39 31.99,33.69 33.55,33.69 v33.57,33.71 | SW3.B2 28.07,2.55 v28.51,2.11 | SW1.B2 3.43,1.38 3.43,1.25 5.93,1.25 v6.08,1.39 | C9.1 16.59,23.35 v15.71,24.24 | C1.1 30.31,15.62 31.1,14.83 v31.1,14.03
  Top 0.457: C7.2 20.52,30.5 v21.01,30.99
  pour Bottom (isolate 0.178): 0.72,33.92 37.37,33.92 37.37,0.94 0.72,0.94 0.72,33.9
LED1  (via drill 0.35)
  Top 0.152: R6.2 33.4,20.98 v33.4,23.19 | v30.3,27.64 31.66,27.64 U2.31
  Bottom 0.152: v33.4,23.19 32.66,23.19 30.3,25.55 v30.3,27.64
LED2  (via drill 0.35)
  Top 0.152: v34.96,23.09 35.02,23.03 35.02,22.03 R7.2 | U2.33 30.34,28.99 v30.01,28.66
  Bottom 0.152: v34.96,23.09 34.47,23.09 31.01,26.54 31.01,28.66 v30.01,28.66
MISO  (via drill 0.35)
  Top 0.152: U2.28 | U2.28 28.54,25.49 v28.46,25.57 | v28.77,3.9 28.49,4.19 24.38,4.19 v24.38,3.19 | v29.01,11.7 29.01,14.25 v29.28,14.51
  Bottom 0.152: v28.46,25.57 28.46,21.46 29.1,20.83 29.1,20.34 28.79,20.03 28.79,15 v29.28,14.51 | SD1.7 25.52,3.31 24.5,3.31 v24.38,3.19 | v29.01,11.7 28.85,11.53 28.85,3.98 v28.77,3.9
MOSI  (via drill 0.35)
  Top 0.152: v23.32,8.55 22.46,9.4 22.46,15.89 21.75,16.61 21.75,17.5 U1.19 21.45,18.7 21.88,19.13 22.62,19.13 v22.93,19.43 | v26.33,23.29 26.33,24.51 26.71,24.89 30.91,24.89 31.02,24.78 31.68,24.78 U2.27
  Bottom 0.152: v23.32,8.55 23.7,8.17 25.94,8.17 SD1.3 | v22.93,19.43 26.33,22.83 v26.33,23.29
N$1
  Top 0.152: R1.2 14.42,20.18 15.85,18.75 U1.11
N$2
  Top 0.152: R2.1 26.36,15.68 U1.26
N$3
  Top 0.152: C4.2 7.76,20.21 8.84,19.13 9.42,19.13 9.55,19 U1.2
N$4
  Top 0.152: C9.2 19.97,23.11 XTAL1.P$1 20.74,23.21 22.17,23.21 22.18,23.23 23.61,23.23 23.61,21.96 U2.13
N$5
  Top 0.152: C4.1 9.06,19.95 10.25,18.76 U1.3
N$6
  Top 0.152: U2.14 24.3,20.76 20.72,20.76 XTAL1.P$2 20.3,21.17 C10.1
N$7
  Top 0.152: C2.2 10.64,19.31 10.93,19.02 10.93,17.82 U1.4
N$8
  Top 0.152: C2.1 11.99,19.77 11.99,19.26 11.67,18.94 11.67,17.82 U1.5
N$9
  Top 0.152: R6.1 33.37,19.32 LED1.A
N$10
  Top 0.152: R7.1 34.91,19.5 35.02,19.39 34.89,19.26 LED2.A
N$11
  Top 0.457: U2.10 20.52,24.79 L1.1
N$12
  Top 0.457: U2.9 21.57,25.49 20.55,26.51 L1.2 20.6,26.61 C7.1
N$13
  Top 0.152: C1.2 28.2,15.67 27.77,16.1 27.77,17.78 U1.28
N$15
  Top 0.152: U1.27 26.75,17.5 26.75,15.02 25.95,14.21 C3.2
N$16
  Top 0.152: R8.2 4.2,19.47 5.91,21.19 CHRG1.5
N$23
  Top 0.152: R11.2 12.77,5.14 U3.12
N$24
  Top 0.152: R12.2 12.69,3.78 U3.11
N$25
  Top 0.152: LED3.C R14.2
N$26
  Top 0.152: R15.2 4.07,3.06 4.05,3.04 3.82,3.27 LED4.C
RESET  (via drill 0.35)
  Top 0.152: C20.2 32.77,10.58 D3.+ | R13.1 D3.+ | D3.+ 34.92,10.58 35.39,11.05 35.39,13.73 36.17,14.51 SW5.1 36.54,15.49 36.54,25.62 DEBUG1.10 | U2.35 32.44,30.39 32.75,30.08 32.75,29.05 v33.1,28.71
  Bottom 0.152: v33.1,28.71 33.68,28.12 33.68,25.32 33.82,25.18 35.82,25.18 DEBUG1.10
RXD.FT  (via drill 0.35)
  Top 0.152: R17.1 8.33,12.11 v8.33,11.62 | v8.83,8.65 8.58,8.4 U3.4
  Bottom 0.152: v8.33,11.62 8.83,11.12 v8.83,8.65
RXD.NRF  (via drill 0.35)
  Top 0.152: U2.21 29.42,21.72 29.42,20.07 v29.82,19.67 | v16.05,12.81 14.44,12.81 R16.2 | v23.18,11.82 24.85,10.16 28.42,10.16 v30.27,12.01
  Bottom 0.152: v16.05,12.81 16.99,11.88 23.13,11.88 v23.18,11.82 | v29.82,19.67 29.91,19.58 29.91,13.06 30.27,12.7 v30.27,12.01
RXLED
  Top 0.152: R14.1 14.64,8.97 14.06,8.39 12.69,8.39 U3.17
SCK  (via drill 0.35)
  Top 0.152: v27.27,24.24 27.62,23.89 31.5,23.89 U2.26 | v20.74,19.5 v20.75,19.5 U1.18 21.05,17.5 21.05,16.61 21.59,16.06 v21.59,10.06
  Bottom 0.152: v27.27,24.24 26.99,24.53 26.17,24.53 21.15,19.5 v20.74,19.5 | v21.59,10.06 21.59,6.56 22.2,5.95 SD1.5
SCL  (via drill 0.35)
  Top 0.152: J1.2 6.27,32.1 7.27,31.1 10.11,31.1 11.98,29.23 R4.1 17.75,29.23 v17.88,29.36 | v24.35,29.32 23.97,29.69 U2.3
  Bottom 0.152: v24.35,29.32 24.31,29.36 v17.88,29.36
SDA  (via drill 0.35)
  Top 0.152: J1.1 5,32.38 5.73,31.66 5.78,31.66 R3.1 8.29,30.3 v8.29,30.32 | v17.12,30.49 16.73,30.1 12.01,30.1 v11.62,30.5 | v23.84,30.32 23.77,30.39 U2.2
  Bottom 0.152: v17.12,30.49 19.16,30.49 20.28,31.61 22.85,31.61 23.84,30.63 v23.84,30.32 | v8.29,30.32 11.45,30.32 v11.62,30.5
SWCLK  (via drill 0.35)
  Top 0.152: U2.36 32.7,31.09 v33.05,30.74
  Bottom 0.152: v33.05,30.74 33.05,30.84 32.52,31.37 32.52,32.2 32.79,32.46 35.82,32.46 36.56,31.73 36.56,31.12 35.82,30.38 DEBUG1.4
SWDIO  (via drill 0.35)
  Top 0.152: U2.37 33.11,31.79 v33.13,31.77
  Bottom 0.152: v33.13,31.77 33.86,31.77 34.25,32.16 35.09,32.16 DEBUG1.2
SWO  (via drill 0.35)
  Top 0.152: U2.32 32.52,28.29 33.03,27.78 v33.06,27.78
  Bottom 0.152: v33.06,27.78 v33.05,27.77 33.05,25.52 33.69,24.87 35.95,24.87 36.56,25.48 36.56,28.02 35.82,28.76 DEBUG1.6
TXD.FT  (via drill 0.35)
  Top 0.152: R16.1 12.59,12.66 v11.57,12.66 | v11.21,10.1 11.41,10.3 U3.20
  Bottom 0.152: v11.57,12.66 11.57,10.46 v11.21,10.1
TXD.NRF  (via drill 0.35)
  Top 0.152: U2.19 27.8,19.88 27.38,19.46 v26.37,19.46 | v19.01,14.38 10.46,14.38 R17.2
  Bottom 0.152: v26.37,19.46 24.07,17.16 21.7,17.16 19.01,14.47 v19.01,14.38
TXLED
  Top 0.152: R15.1 7.33,3.54 U3.10
USB+  (via drill 0.35)
  Top 0.152: C18.1 16.66,1.49 13.27,1.49 R12.1 12.04,1.89 11.8,1.64 7.54,1.64 v7.3,1.89
  Bottom 0.152: v7.3,1.89 5.55,3.64 5.55,4 5.32,4.22 3.8,4.22 3.67,4.36 3.67,5.6 3.8,5.74 4.52,5.74 USB1.3
USB-  (via drill 0.35)
  Top 0.152: C17.2 15.98,5.16 R11.1 15.96,3.51 15.98,3.49 15.98,2 15.85,1.87 14.11,1.87 13.97,2 13.97,2.16 13.28,2.86 12.23,2.86 9.6,5.49 v8.83,5.49
  Bottom 0.152: USB1.2 8.65,5.31 v8.83,5.49
V_USB  (via drill 0.35)
  Top 0.152: U3.15 12.47,6.91 12.02,6.91 11.8,6.69 v11.58,6.69
  Bottom 0.152: v11.58,6.69 9.32,4.42 D2.+
  Bottom 0.406: USB1.1 6.28,4.66 D2.+
VIN  (via drill 0.35)
  Top 0.152: LDO1.1 5.19,28.96 5.02,28.79 5.02,26.94 5.85,26.94 5.88,26.98 LDO1.3 5.91,27.03 | 5.91,27.03 CHRG1.4 | v5.09,16.68 v5.08,16.68 v2.29,16.68 | v1.63,22.44 3.01,23.82 3.01,24.23 R5.2 3.59,25.28 3.59,26.85 | C13.2 2.07,26.85 3.59,26.85 | 3.59,26.85 C14.2 3.8,27.03 5.91,27.03
  Bottom 0.152: D2.- 6.51,6.73 D1.- 6.51,9.27 7.2,9.97 7.2,11.67 5.09,13.79 v5.09,16.68 | v1.63,22.44 1.69,22.38 1.69,17.28 v2.29,16.68
VLIPO  (via drill 0.35)
  Top 0.152: R9.2 12.02,26.36 10.81,25.15 C16.1 9.76,25.73 CHRG1.3 8.43,25.65 v7.16,25.65 | J2.2 4.17,14.31 v4.3,14.31
  Bottom 0.152: v4.3,14.31 4.3,19.91 3.52,20.68 3.52,22.01 v7.16,25.65
  Bottom 0.61: J2.2 5.72,12.4 6.51,11.62 D1.+